# EAGLE schematic readerstation (EAGLE 6.5.0)
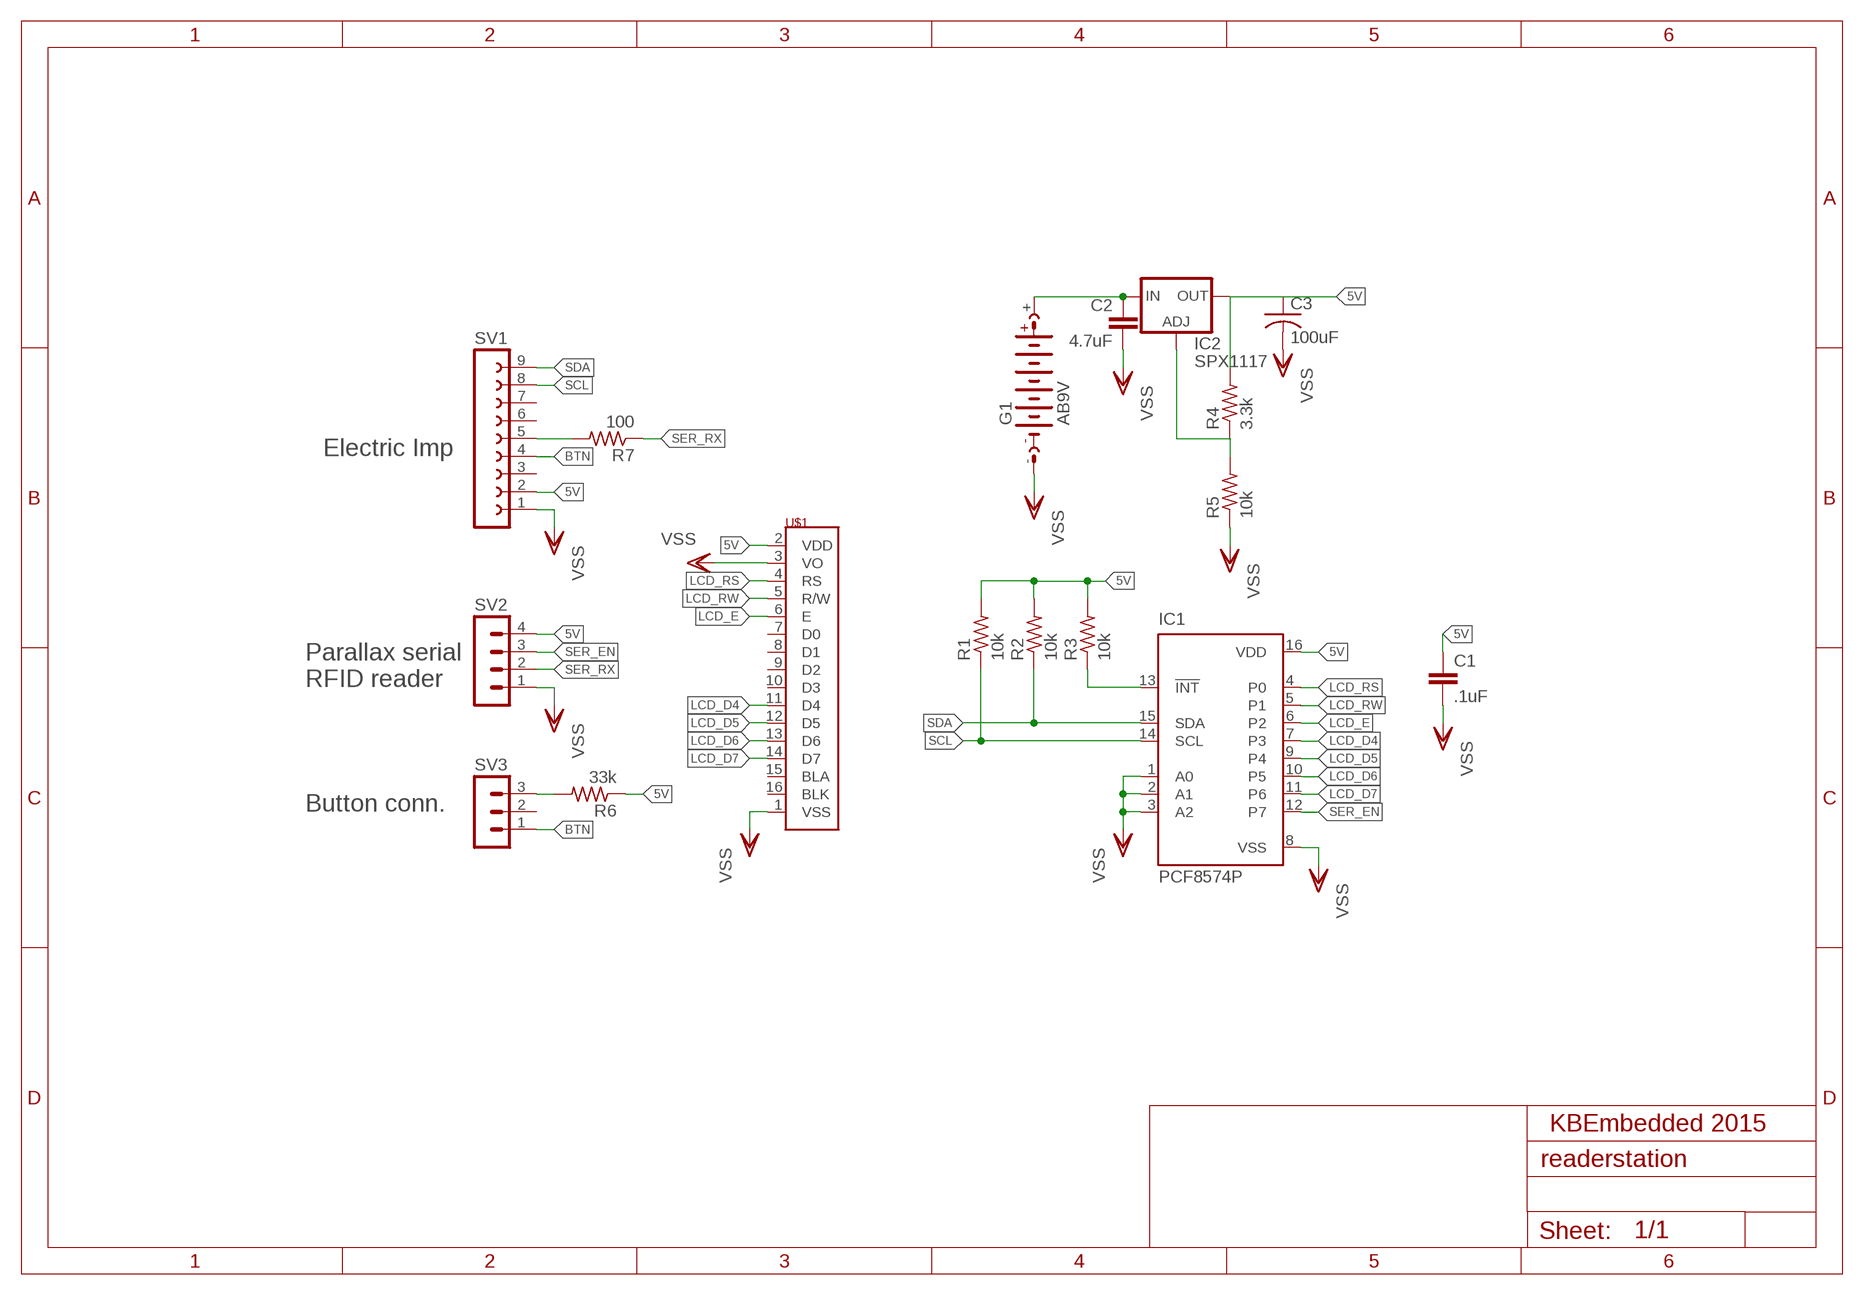
[diagram p0: schematic, sheet 1]

## Parts
C1  .1uF  C-EU025-024X044  [C025-024X044]
C2  4.7uF  C-EU025-024X044  [C025-024X044]
C3  100uF  C-US025-024X044  [C025-024X044]
G1  AB9V  [AB9V]
IC1  PCF8574P  [DIL16]
IC2  SPX1117  LD117AS12TR  [SOT223]
R1  10k  R-US_0204/5  [0204/5]
R2  10k  R-US_0204/5  [0204/5]
R3  10k  R-US_0204/5  [0204/5]
R4  3.3k  R-US_0204/5  [0204/5]
R5  10k  R-US_0204/5  [0204/5]
R6  33k  R-US_0204/5  [0204/5]
R7  100  R-US_0204/5  [0204/5]
SV1  FE09-1  [FE09]
SV2  MA04-1  [MA04-1]
SV3  MA03-1  [MA03-1]
U$1  TRULY_2X16_CHARLCD  [TRULY_2X16_CHARLCD]

## Nets
5V: C1.1 C3.1 IC1.16(VDD) IC2.4(OUT) R1.2 R2.2 R3.2 R4.2 R6.1 SV1.2 SV2.4 U$1.2(VDD)
BTN: SV1.4 SV3.1
LCD_D4: IC1.7(P3) U$1.11(D4)
LCD_D5: IC1.9(P4) U$1.12(D5)
LCD_D6: IC1.10(P5) U$1.13(D6)
LCD_D7: IC1.11(P6) U$1.14(D7)
LCD_E: IC1.6(P2) U$1.6(E)
LCD_RS: IC1.4(P0) U$1.4(RS)
LCD_RW: IC1.5(P1) U$1.5(R/W)
N$1: SV2.1
N$2: R7.2 SV1.5
N$3: C2.1 G1.+ IC2.3(IN)
N$5: IC2.1(ADJ) R4.1 R5.2
N$10: R6.2 SV3.3
N$11: IC1.13(!INT) R3.1
SCL: IC1.14(SCL) R1.1 SV1.8
SDA: IC1.15(SDA) R2.1 SV1.9
SER_EN: IC1.12(P7) SV2.3
SER_RX: R7.1 SV2.2
VSS: C1.2 C2.2 C3.2 G1.- IC1.1(A0) IC1.2(A1) IC1.3(A2) IC1.8(VSS) R5.1 SV1.1 U$1.1(VSS) U$1.3(VO)
Unconnected: SV1.3 SV1.6 SV1.7 SV3.2 U$1.7(D0) U$1.8(D1) U$1.9(D2) U$1.10(D3) U$1.15(BLA) U$1.16(BLK)

## Notes on the sheet
- Electric Imp
- Parallax serial
  RFID reader
- Button conn.
- KBEmbedded 2015

## Library data of the parts
C1 C2 = rcl:C-EU: CAPACITOR, European symbol
C3 = rcl:C-US: CAPACITOR, American symbol
G1 = battery:AB9V: 9-V BATTERY CLIP
IC1 = micro-philips:PCF8574: I2C-Bus Remote 8-bit I/O expander http://www.semiconductors.philips.com/acrobat_download/datasheets/PCF8574_4.pdf; MPN: PCF8574PN; OC_FARNELL: 204020; OC_NEWARK: 11N8515
IC2 = v-reg:LD117A?*: Low drop fixed and adjustable positive voltage regulators 1 A Source: http://www.st.com/stonline/products/literature/ds/7194/ld1117axx.pdf
R1-R7 = rcl:R-US_: RESISTOR, American symbol
SV1 = con-lsta:FE09-1: FEMALE HEADER; OC_FARNELL: unknown; OC_NEWARK: unknown
SV2 = con-lstb:MA04-1: PIN HEADER; OC_FARNELL: unknown; OC_NEWARK: unknown
SV3 = con-lstb:MA03-1: PIN HEADER; OC_FARNELL: unknown; OC_NEWARK: unknown
U$1 = cuslibrary:TRULY_2X16_CHARLCD